# EAGLE design SGP30 Breakout (EAGLE 9.6.0)
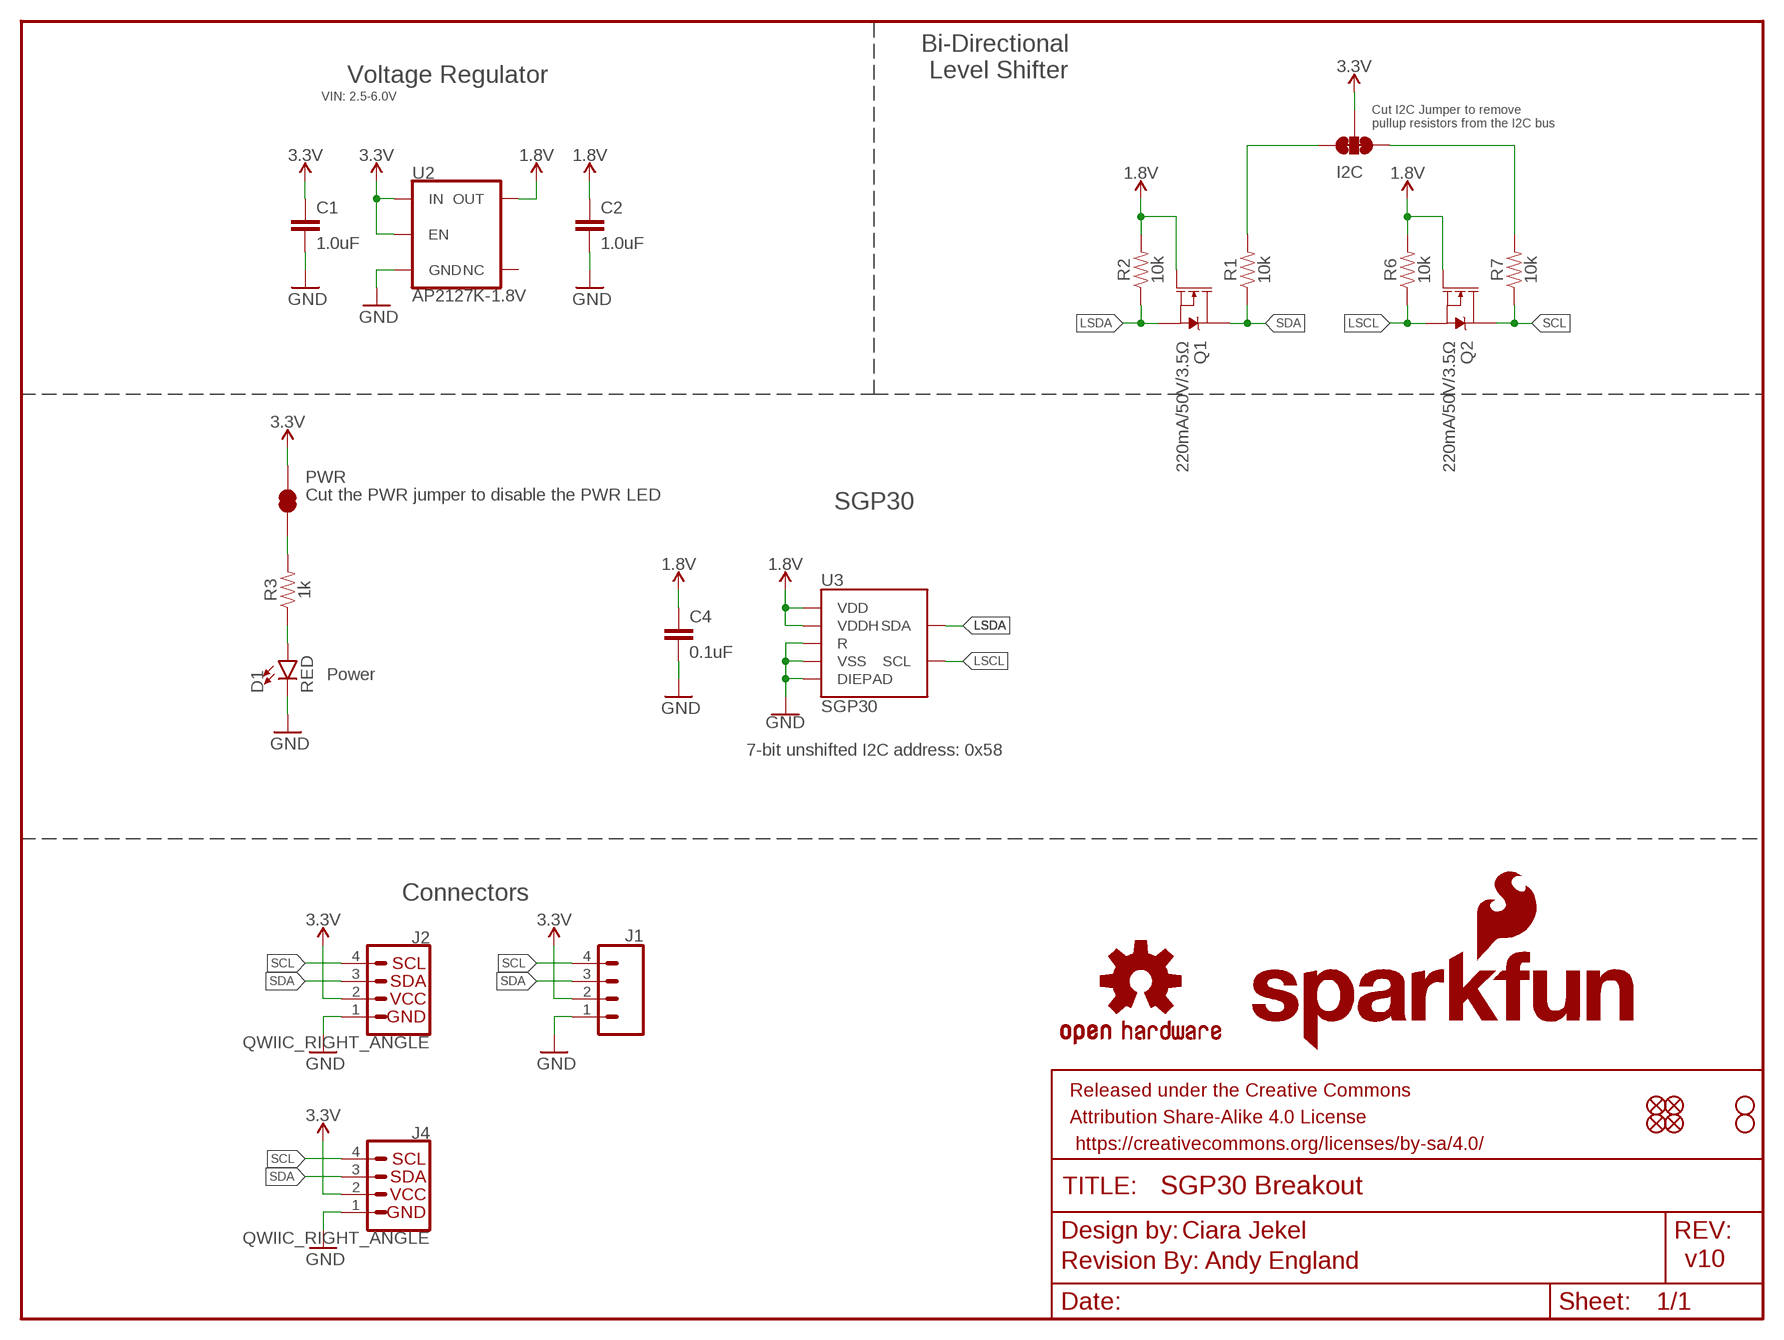
[diagram p0: schematic, sheet 1]

## Parts
C1  1.0uF  1.0UF-0603-16V-10%  [0603]
C2  1.0uF  1.0UF-0603-16V-10%  [0603]
C4  0.1uF  0.1UF-0603-25V-(+80/-20%)  [0603]
D1  RED  LED-RED0603  [LED-0603]
FRAME1  FRAME-LETTER  [CREATIVE_COMMONS]
I2C  JUMPER-SMT_3_2-NC_TRACE_SILK  [SMT-JUMPER_3_2-NC_TRACE_SILK]
J1  CONN_041X04_NO_SILK  [1X04_NO_SILK]
J2  QWIIC_RIGHT_ANGLE  QWIIC_CONNECTORJS-1MM  [JST04_1MM_RA]
J4  QWIIC_RIGHT_ANGLE  QWIIC_CONNECTORJS-1MM  [JST04_1MM_RA]
JP1  FIDUCIALUFIDUCIAL  [MICRO-FIDUCIAL]
JP2  FIDUCIALUFIDUCIAL  [MICRO-FIDUCIAL]
JP3  STAND-OFF  [STAND-OFF]
JP4  STAND-OFF  [STAND-OFF]
JP5  FIDUCIALUFIDUCIAL  [MICRO-FIDUCIAL]
JP6  FIDUCIALUFIDUCIAL  [MICRO-FIDUCIAL]
LOGO2  REVISION  [REVISION]
LOGO3  SFE_LOGO_NAME_FLAME.1_INCH  [SFE_LOGO_NAME_FLAME_.1]
LOGO4  SFE_LOGO_NAME_FLAME.1_INCH  [SFE_LOGO_NAME_FLAME_.1]
LOGO5  OSHW-LOGOS  [OSHW-LOGO-S]
PWR  JUMPER-SMT_2_NC_TRACE_SILK  [SMT-JUMPER_2_NC_TRACE_SILK]
Q1  220mA/50V/3.5Ω  MOSFET-NCH-BSS138  [SOT23-3]
Q2  220mA/50V/3.5Ω  MOSFET-NCH-BSS138  [SOT23-3]
R1  10k  10KOHM-0603-1/10W-1%  [0603]
R2  10k  10KOHM-0603-1/10W-1%  [0603]
R3  1k  1KOHM-0603-1/10W-1%  [0603]
R6  10k  10KOHM-0603-1/10W-1%  [0603]
R7  10k  10KOHM-0603-1/10W-1%  [0603]
U2  AP2127K-1.8V  V_REG_AP2127K-1.8V  [SOT23-5]
U3  SGP30  [SGP30]

## Nets
1.8V: C2.1 C4.1 Q1.1(G) Q2.1(G) R2.2 R6.2 U2.5(OUT) U3.1(VDD) U3.5(VDDH)
3.3V: C1.1 I2C.2 J1.2 J2.2 J4.2 PWR.2 U2.1(IN) U2.3(EN)
GND: C1.2 C2.2 C4.2 D1.C J1.1 J2.1 J4.1 U2.2(GND) U3.2(VSS) U3.4(R) U3.DIEPAD
LSCL: Q2.2(S) R6.1 U3.6(SCL)
LSDA: Q1.2(S) R2.1 U3.3(SDA)
N$1: PWR.1 R3.2
N$2: I2C.3 R1.2
N$3: D1.A R3.1
N$4: I2C.1 R7.2
SCL: J1.4 J2.4 J4.4 Q2.3(D) R7.1
SDA: J1.3 J2.3 J4.3 Q1.3(D) R1.1
Unconnected: U2.4(NC)

## Notes on the sheet
- Bi-Directional 
  Level Shifter
- Voltage Regulator
- VIN: 2.5-6.0V
- Cut I2C Jumper to remove 
  pullup resistors from the I2C bus
- Cut the PWR jumper to disable the PWR LED | SGP30
- Power
- 7-bit unshifted I2C address: 0x58
- Connectors
- Ciara Jekel
- Andy England | v10

## Library data of the parts
C1 C2 = SparkFun-Capacitors:1.0UF: 1µF ceramic capacitors A capacitor is a passive two-terminal electrical component used to store electrical energy temporarily in an electric field.; PROD_ID: CAP-00868
C4 = SparkFun-Capacitors:0.1UF: 0.1µF ceramic capacitors A capacitor is a passive two-terminal electrical component used to store electrical energy temporarily in an electric field.; PROD_ID: CAP-00810
D1 = SparkFun-LED:LED-RED: Red SMD LED Used in manufacturing of most products at SparkFun Packages: 0603 - SMD 0603 package [Product Link] <http://docs.avagotech.com/docs/AV02-0551EN> 0603 SMART - SMD 0603 SMART package ( more efficient and expensive)[Product Link] <http://www.osram-os.com/Graphics/XPic2/00077099_0.pdf> 1206 - SMD1206 package [Product Link] <https://www.sparkfun.com/datasheets/DevTools/LilyPad/Q150OVS4.pdff> SparkFun Products: Pro Mini 328 -5V <https://www.sparkfun.com/products/821> RedBoard <https://www.sparkfun.com/products/12757> IOIO-OTG <https://www.sparkfun.com/products/13613>; PROD_ID: DIO-00819
FRAME1 = SparkFun-Aesthetics:FRAME-LETTER: Schematic Frame - Letter Standard 8.5x11 US Letter frame
I2C = SparkFun-Jumpers:JUMPER-SMT_3_2-NC_TRACE: Normally closed trace jumper (2 of 2 connections) This jumper has a trace between all three pads so they are normally closed (NC). Use a razor knife to open the connection(s). For best results follow the IPC guidelines for cutting traces: Cutout at least 0.063 mm (0.005 in). Remove all loose material to clean up the cut area. Seal the cut with an approved epoxy. Reapply solder to reclose the connection(s).
J1 = SparkFun-Connectors:CONN_04: Multi connection point. Often used as Generic Header-pin footprint for 0.1 inch spaced/style header connections On any of the 0.1 inch spaced packages, you can populate with these: Break Away Headers - Straight <https://www.sparkfun.com/products/116> (PRT-00116) Break Away Male Headers - Right Angle <https://www.sparkfun.com/products/553> (PRT-00553) Female Headers <https://www.sparkfun.com/products/115> (PRT-00115) Break Away Headers - Machine Pin <https://www.sparkfun.com/products/117> (PRT-00117) Break Away Female Headers - Swiss Machine Pin <https://www.sparkfun.com/products/743> (PRT-00743) For SCREWTERMINALS and SPRING TERMINALS visit here: Screw Terimnals on SparkFun.com <https://www.sparkfun.com/search/results?term=Screw+Terminals> (5mm/3.5mm/2.54mm spacing) This device is also useful as a general connection point to wire up your design to another part of your project. Our various solder wires solder well into these plated through hole pads. Hook-Up Wire - Assortment (Stranded, 22 AWG) <https://www.sparkfun.com/products/11375> (PRT-11375) Hook-Up Wire - Assortment (Solid Core, 22 AWG) <https://www.sparkfun.com/products/11367> (PRT-11367) View the entire wire category on our website here <https://www.sparkfun.com/categories/141> Special notes: Molex polarized connector foot print use with SKU : PRT-08231 with associated crimp pins and housings. 1MM SMD Version SKU: PRT-10208; PROD_ID: CONN-09696
J2 J4 = SparkFun-Connectors:QWIIC_CONNECTOR: SparkFun I2C Standard Qwiic Connector An SMD 1mm pitch JST connector makes it easy and quick (get it? Qwiic?) to connect I2C devices to each other. The Qwiic system <http://www.sparkfun.com/qwiic> enables fast and solderless connection between popular platforms and various sensors and actuators. We carry 200mm <https://www.sparkfun.com/products/14204>, 100mm <https://www.sparkfun.com/products/14205>, 50mm <https://www.sparkfun.com/products/14206>, and breadboard friendly <https://www.sparkfun.com/products/14207> Qwiic cables. We also offer 10 pcs strips <https://www.sparkfun.com/products/14323> the SMD connectors.; PROD_ID: CONN-13694
JP1 JP2 JP5 JP6 = SparkFun:FIDUCIAL: Fiducial Alignment Points Various fiducial points for machine vision alignment.
JP3 JP4 = SparkFun:STAND-OFF: Stand Off This is the mechanical footprint for a #4 phillips button head screw. Use the keepout ring to avoid running the screw head into surrounding components. SKU : PRT-00447
LOGO2 = SparkFun-Aesthetics:REVISION: "Revision By" Text Preceding text for revisor documentation. Includes schematic text on "symbols" layer, and board text on tDoc.
LOGO3 LOGO4 = SparkFun-Aesthetics:SFE_LOGO_NAME_FLAME: SparkFun Font Logo w/ Flame This is the SparkFun full logo. The logo on the schematic will always be the same size; the package variant is the height of the flame part of the logo. Default layer for the logo on the board is tSilk.
LOGO5 = SparkFun-Aesthetics:OSHW-LOGO: Open-Source Hardware (OSHW) Logo This logo indicates the piece of hardware it is found on incorporates a OSHW license and/or adheres to the definition of open source hardware found here: http://freedomdefined.org/OSHW
PWR = SparkFun-Jumpers:JUMPER-SMT_2_NC_TRACE: Normally closed trace jumper This jumper has a trace between two pads so it's normally closed (NC). Use a razor knife to open the connection. For best results follow the IPC guidelines for cutting traces: Cutout at least 0.063 mm (0.005 in). Remove all loose material to clean up the cut area. Seal the cut with an approved epoxy. Reapply solder to reclose the connection.
Q1 Q2 = SparkFun-DiscreteSemi:MOSFET-NCH: N-channel MOSFETs Voltage controlled devices that allow control of high current outputs. SparkFun Products: SparkFun OpenScale <https://www.sparkfun.com/products/13261> SparkFun Digital Sandbox <https://www.sparkfun.com/products/12651> SparkFun Monster Moto Shield <https://www.sparkfun.com/products/10182> SparkFun MOSFET Power Controller <https://www.sparkfun.com/products/11214>; PROD_ID: TRANS-00830
R1 R2 R6 R7 = SparkFun-Resistors:10KOHM: 10kΩ resistor A resistor is a passive two-terminal electrical component that implements electrical resistance as a circuit element. Resistors act to reduce current flow, and, at the same time, act to lower voltage levels within circuits. - Wikipedia; PROD_ID: RES-00824
R3 = SparkFun-Resistors:1KOHM: 1kΩ resistor A resistor is a passive two-terminal electrical component that implements electrical resistance as a circuit element. Resistors act to reduce current flow, and, at the same time, act to lower voltage levels within circuits. - Wikipedia; PROD_ID: RES-07856
U2 = SparkFun-IC-Power:V_REG_AP2127: AP2127 - 300mA CMOS LDO Regulator w/ Enable The AP2127 is CMOS process low dropout linear regulator with enable function, the regulator delivers a guaranteed 300mA (min.) continuous load current. Features Output Voltage Accuracy: ±1.5% Output Current: 300mA (Min.) Foldback Short Current Protection: 50mA Enable Function to Turn ON/OFF VOUT Low Dropout Voltage (3.3V): 250mV (Typ.) @IOUT=600mA Excellent Load Regulation: 0.2%/A (Typ.) Excellent Line Regulation: 0.02%/V (Typ.) Low Quiescent Current: 55μA (Typ.) Low Standby Current: 0.01μA (Typ.) Low Output Noise: 50μVRMS PSRR: 100Hz -65dB, 1kHz -65dB OTSD Protection Stable with 1.0μF Flexible Cap: Ceramic, Tantalum and Aluminum Electrolytic Operation Temperature Range: -40°C to 85°C ESD: MM 400V, HBM 4000V; PROD_ID: VREG-14239
U3 = SparkFun-Sensors:SGP30: The SGP30 is a digital multi-pixel gas sensor designed for easy integration into air purifier, demand-controlled ventilation, and IoT applications.; PROD_ID: IC-14776

## Net classes
1 power: width 0.203 mm

## Board
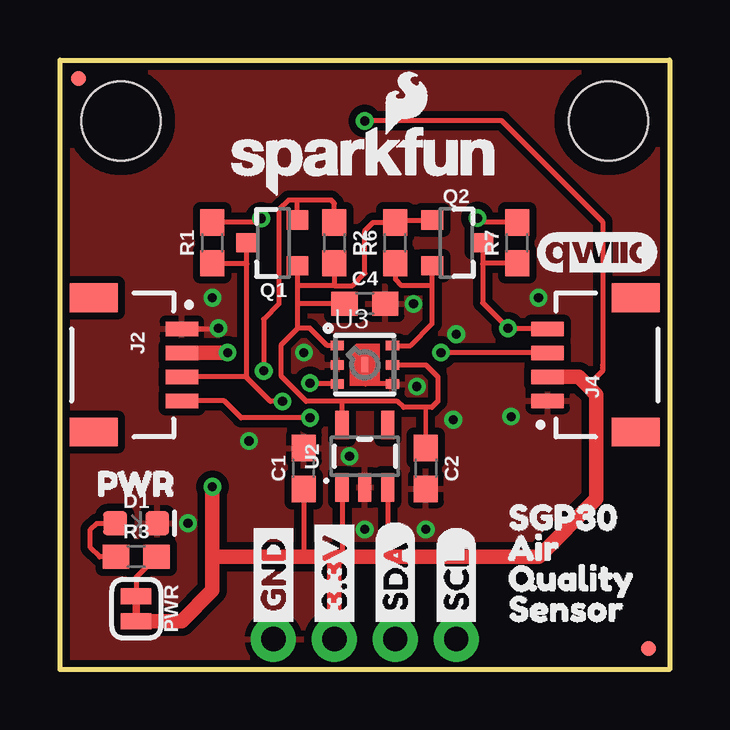
[diagram p1: board, top side]
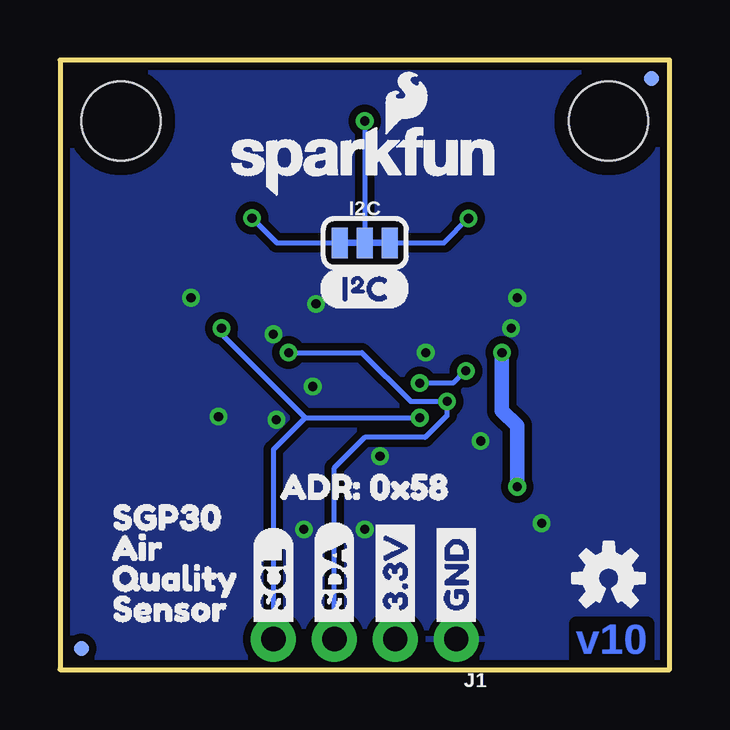
[diagram p2: board, bottom side, seen from below]

Size 25.4 x 25.4 mm. Coordinates in mm from the lower left corner, seen from the top.
Outline: 0,0 0,25.4 25.4,25.4 25.4,0 0,0
Copper layers (1*16): Top 0.035mm / dielectric 1.5mm / Bottom 0.035mm
Design rules "SparkFun-2-layer-TIGHT": minimum track width 7mil, minimum drill 15mil, track to track 7mil, track to pad 7mil, pad to pad 7mil, via to via 7mil, smd to smd 7mil, copper to edge 7mil, drill to drill 7mil, minimum pad ring 7mil, minimum via ring 7mil, stop-mask expansion 4mil, vias tented up to drill 25mil, thermal gap 10mil

### Footprints (pad centres in the part's own frame; a part is rotated, then mirrored left to right if it is on the bottom)
0603 = smd 1.1 x 1: 1 -0.85,0; 2 0.85,0
LED-0603 = smd 1 x 1: A -0.877,0; C 0.877,0
SMT-JUMPER_3_2-NC_TRACE_SILK = smd 0.66 x 1.27: 1 -1.041,0; 2 0,0; 3 1.041,0
1X04_NO_SILK = drill 1.016 pad 1.88: 1 0,0; 2 2.54,0; 3 5.08,0; 4 7.62,0
JST04_1MM_RA = smd 0.6 x 1.35: 1 -1.5,0; 2 -0.5,0; 3 0.5,0; 4 1.5,0 | smd 1.2 x 2: NC1 2.8,-3.675; NC2 -2.8,-3.675
MICRO-FIDUCIAL = smd 0.635 x 0.635: 1 0,0
STAND-OFF = hole 3.302: 0,0
SMT-JUMPER_2_NC_TRACE_SILK = smd 0.66 x 1.27: 1 -0.521,0; 2 0.521,0
SOT23-3 = smd 0.8 x 0.9: 1 -0.95,-1; 2 0.95,-1; 3 0,1.1
SOT23-5 = smd 0.55 x 1.2: 1 -0.95,-1.3; 2 0,-1.3; 3 0.95,-1.3; 4 0.95,1.3; 5 -0.95,1.3
SGP30 = smd 0.55 x 0.4: 1 -1.15,0.8; 2 -1.15,0; 3 -1.15,-0.8; 4 1.15,-0.8; 5 1.15,0; 6 1.15,0.8 | smd 0.305 x 0.61: DIEPAD 0,0

### Placement (x,y rotation side)
C1  10.16,8.38 90 top
C2  15.24,8.38 270 top
C4  12.7,15.24 0 top
D1  3.17,6.1 0 top
FRAME1  -12.7,-12.7 0 top  (outside the outline)
I2C  12.7,17.78 0 bottom
J1  8.89,1.27 180 bottom
J2  5.08,12.7 270 top
J4  20.32,12.7 90 top
JP1  0.76,24.64 0 bottom
JP2  24.51,0.89 0 top
JP3  2.54,22.86 0 top
JP4  22.86,22.86 0 top
JP5  24.51,0.89 0 bottom
JP6  0.76,24.64 0 top
LOGO2  -1.27,-15.24 0 top  (outside the outline)
LOGO3  12.7,21.21 0 top
LOGO4  12.7,21.21 0 bottom
LOGO5  2.54,3.81 0 bottom
PWR  3.17,2.54 270 top
Q1  8.89,17.78 90 top
Q2  16.51,17.78 270 top
R1  6.35,17.78 90 top
R2  11.43,17.78 270 top
R3  3.17,4.7 0 top
R6  13.97,17.78 90 top
R7  19.05,17.78 90 top
U2  12.7,8.89 0 top
U3  12.7,12.7 0 top
U$1  [_AIR1]  17.4,5.08 0 top
U$2  [QUALITY2]  17.78,3.81 0 top
U$3  [GND1]  8.89,1.52 90 bottom
U$4  [3#3V2]  11.43,1.52 90 bottom
U$5  [SDA8]  13.97,1.52 90 bottom
U$6  [SCL9]  16.51,1.52 90 bottom
U$7  [SENSOR3]  17.78,2.54 0 top
U$8  [SGP300]  17.78,6.35 0 top
U$9  [SGP300]  24.13,6.35 0 bottom
U$11  [_AIR1]  24.51,5.08 0 bottom
U$12  [QUALITY2]  24.13,3.81 0 bottom
U$13  [SENSOR3]  24.13,2.54 0 bottom
U$14  [ADR#_0X580]  17.14,7.62 0 bottom
U$15  [I2C]  14.61,15.88 0 bottom
U$16  [QWIIC_5MM]  22.35,17.4 0 top
U$17  [PWR_TO]  0.64,7.75 0 top
U$21  [3#3V2]  11.43,1.52 90 top
U$22  [GND1]  8.89,1.52 90 top
U$26  [SCL9]  16.51,1.52 90 top
U$27  [SDA8]  13.97,1.52 90 top

### Tracks (layer width: path | path; a pad name or v marks a point on that pad's centre or on a via)
1.8V
  Top 0.178: C2.1 15.24,10.92
  Top 0.203: 11.75,11.18 10.26,11.18 9.22,12.21 9.22,13.54 9.91,14.22 | U2.5 11.75,11.18 | R2.2 11.43,16 | 11.43,16 12.19,16 12.7,16.51 12.7,18.29 13.04,18.63 R6.2 14.07,18.73 Q2.1 | 9.91,14.22 9.91,15.24 | 9.91,15.24 9.91,16 | 9.91,16 9.91,16.81 Q1.1 | C4.1 9.91,15.24 | 11.43,16 9.91,16 | 9.91,14.22 10.41,14.22 11.14,13.5 U3.1 | U3.5 15.24,12.7 15.75,12.19 15.75,11.18 15.49,10.92 15.24,10.92 14.31,10.92 14.06,11.18 11.75,11.18
3.3V  (via drill 0.38)
  Top 0.203: 20.19,12.2 J4.2 | J2.2 | C1.1 10.16,4.7 | U2.1 11.75,4.76 11.68,4.7 | U2.3 13.65,4.76 13.59,4.7 | v12.7,22.86 18.41,22.86 22.61,18.67 22.61,12.7 22.61,12.57 22.61,12.45 21.99,11.83
  Top 0.61: J2.2 v6.99,13.21 | 11.43,4.7 11.68,4.7 13.59,4.7 19.94,4.7 22.35,7.11 22.35,11.46 21.99,11.83 21.61,12.21 J4.2 | 11.43,4.7 10.16,4.7 6.35,4.7 | v6.35,7.62 6.35,4.7 | 6.35,4.7 6.35,3.3 5.07,2.02 PWR.2 | J1.2 11.43,4.7
  Bottom 0.203: v12.7,22.86 I2C.2
  Bottom 0.61: v6.99,13.21 6.99,10.79 6.35,10.16 v6.35,7.62
GND  (via drill 0.38)
  Top 0.203: J2.1 6.58,14.2 v6.6,14.22 | 18.82,10.56 v18.8,10.54 | U2.2 12.7,7.87 | U3.4 12.74,11.9 12.7,11.94 U3.DIEPAD
  other vias: 10.16,13.21 14.87,11.8 6.35,15.49 15.24,5.84 16.38,10.41 16.51,13.97 19.94,15.49 12.7,5.84 12.06,8.89 7.87,9.53 5.33,6.1 14.73,15.24
  pour Bottom (isolate 0.305): 0,0 0,25.4 25.4,25.4 25.4,0
  pour Top (isolate 0.305): 0,0 0,25.4 25.4,25.4 25.4,0
LSCL
  Top 0.203: R6.1 13.97,16.26 14.22,16 15.51,16 | 15.51,16 15.51,14.4 14.61,13.5 U3.6 | 15.51,16 Q2.2
LSDA  (via drill 0.38)
  Top 0.203: v10.41,11.94 10.45,11.9 U3.3 | R2.1 11.43,19.43 11.3,19.56 9.91,19.56 | 9.91,19.56 9.53,19.56 9.12,19.15 9.12,15.24 8.49,14.61 v8.49,12.45 | Q1.2 9.89,19.54 9.91,19.56
  Bottom 0.203: v8.49,12.45 8.51,12.45 9.02,11.94 v10.41,11.94
N$1
  Top 0.203: R3.2 3.17,3.85 PWR.1
N$2  (via drill 0.38)
  Top 0.203: v8.38,18.8 8.22,18.63 R1.2
  Bottom 0.203: I2C.3 9.4,17.78 v8.38,18.8
N$3
  Top 0.203: R3.1 1.65,4.7 1.27,5.08 1.27,5.84 1.52,6.1 D1.A
N$4  (via drill 0.38)
  Top 0.203: R7.2 17.58,18.63 v17.4,18.81
  Bottom 0.203: v17.4,18.81 16.37,17.78 I2C.1
SCL  (via drill 0.38)
  Top 0.203: J4.4 20.3,14.22 v18.67,14.22 17.61,15.28 17.61,16.89 | v10.41,10.49 7.54,10.49 6.83,11.2 J2.4 | Q2.3 17.61,16.89 | R7.1 17.65,16.93 17.61,16.89
  Bottom 0.203: v18.67,14.22 18.67,13.97 15.19,10.49 | 15.19,10.49 v10.41,10.49 | 15.19,10.49 16.51,9.17 J1.4
SDA  (via drill 0.38)
  Top 0.203: J4.3 v15.88,13.2 v15.88,13.21 | v9.27,11.18 8.76,11.18 7.74,12.2 | 7.74,12.2 7.79,12.2 7.79,16.89 | 7.74,12.2 J2.3 | 7.79,16.89 Q1.3 | R1.1 7.75,16.93 7.79,16.89
  Bottom 0.203: v15.88,13.21 12.83,13.21 10.79,11.18 v9.27,11.18 9.27,10.59 10.19,9.68 12.7,9.68 13.97,8.41 J1.3

### Text on the board
Bottom: v10
Measures: Dimensions in inches
tDocu: Ciara Jekel | Andy England